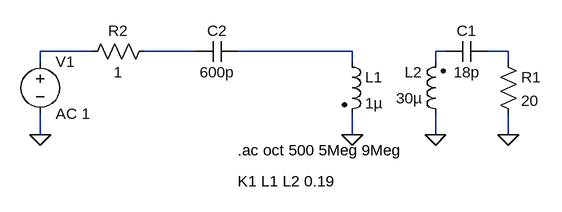
[diagram p0: schematic coil_model.asc]
coil_model.asc, the LTspice schematic file:
Version 4
SHEET 1 880 680
WIRE -336 112 -416 112
WIRE -176 112 -256 112
WIRE 64 112 -112 112
WIRE 208 112 192 112
WIRE 304 112 272 112
WIRE -416 128 -416 112
WIRE 64 128 64 112
WIRE 192 128 192 112
WIRE 304 128 304 112
WIRE -416 240 -416 208
WIRE 64 240 64 208
WIRE 192 240 192 208
WIRE 304 240 304 208
FLAG 192 240 0
FLAG 64 240 0
FLAG -416 240 0
FLAG 304 240 0
SYMBOL ind2 48 112 R0
SYMATTR InstName L1
SYMATTR Value 1µ
SYMATTR Type ind
SYMBOL ind2 208 224 R180
WINDOW 0 36 80 Left 2
WINDOW 3 36 40 Left 2
SYMATTR InstName L2
SYMATTR Value 30µ
SYMATTR Type ind
SYMATTR SpiceLine Rser=0.001m
SYMBOL cap 272 96 R90
WINDOW 0 0 32 VBottom 2
WINDOW 3 32 32 VTop 2
SYMATTR InstName C1
SYMATTR Value 18p
SYMBOL res 288 112 R0
SYMATTR InstName R1
SYMATTR Value 20
SYMBOL voltage -416 112 R0
WINDOW 123 0 0 Left 2
WINDOW 39 0 0 Left 2
SYMATTR InstName V1
SYMATTR Value AC 1
SYMBOL res -352 128 R270
WINDOW 0 32 56 VTop 2
WINDOW 3 0 56 VBottom 2
SYMATTR InstName R2
SYMATTR Value 1
SYMBOL cap -112 96 R90
WINDOW 0 0 32 VBottom 2
WINDOW 3 32 32 VTop 2
SYMATTR InstName C2
SYMATTR Value 600p
TEXT -112 264 Left 2 !.ac oct 500 5Meg 9Meg
TEXT -112 312 Left 2 !K1 L1 L2 0.19

The netlist it stands for:
* coil_model.asc
L1 N003 0 1µ
L2 0 N004 30µ Rser=0.001m
C1 N005 N004 18p
R1 N005 0 20
V1 N001 0 AC 1
R2 N001 N002 1
C2 N003 N002 600p
.ac oct 500 5Meg 9Meg
K1 L1 L2 0.19
.backanno
.end